# Altium schematic sheet MOC3063S.SchDoc: AC Actuator Control
size 148 x 105 mm; DocumentNumber: 7; SheetNumber: 7; SheetTotal: 10
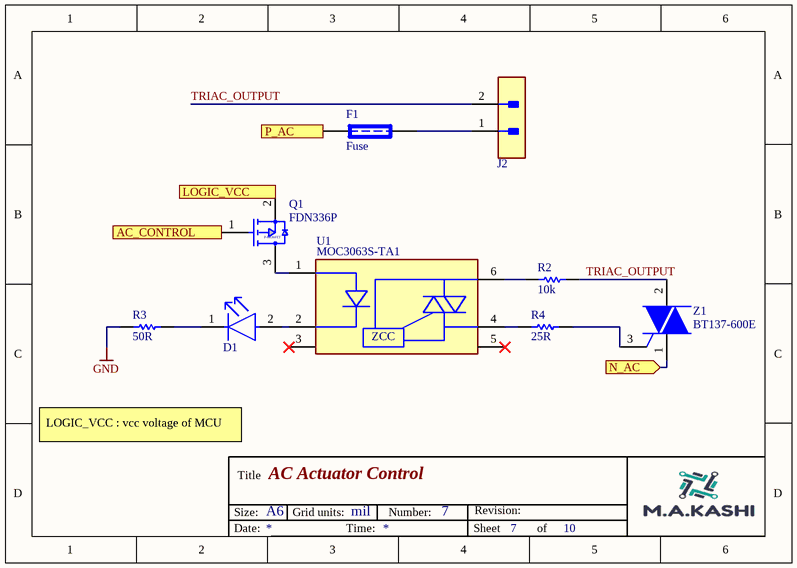
[diagram p0: MOC3063S.SchDoc]

## Parts
D1  LED  [LED_1206_red_Dialight]  (value not drawn)
F1  Fuse  [FUSE]
J2  Connector  [Phoenix 2 0D]  (value not drawn)
Q1  FDN336P  [ON_Semiconductor_527AG_IPC_A]
R2  10k  [RES_0805_A]
R3  50R  [RES_0805_A]
R4  25R  [RES_0805_A]
U1  Part Number: MOC3063S-TA1  [Lite-On_Inc._SMD6_0]  (hidden comment: IC_Lite-On_Inc._MOC3063S-TA1_eec)
Z1  BT137-600E  [sot78]

## Ports
AC_CONTROL (in), LOGIC_VCC (in), N_AC (in), P_AC (in)

## Nets
GND: R3.1
AC_CONTROL: Q1.1(G) ; port AC_CONTROL
LOGIC_VCC: Q1.2(S) ; port LOGIC_VCC
N_AC: Z1.1(T1) ; port N_AC
P_AC: F1.1 ; port P_AC
TRIAC_OUTPUT: J2.2 R2.2 Z1.2(T2)
NetD1_1: D1.1(C) R3.2
NetD1_2: D1.2(A) U1.2(C)
NetF1_2: F1.2 J2.1
NetQ1_3: Q1.3(D) U1.1(A)
NetR2_1: R2.1 U1.6(2_MAIN_TERMINAL)
NetR4_1: R4.1 U1.4(1_MAIN_TERMINAL)
NetR4_2: R4.2 Z1.3(G)

Not connected (* = marked no-connect by the designer): U1 3(NC)* 5(SUBSTRATE)*

## Notes on the sheet
- LOGIC_VCC : vcc voltage of MCU
- Size:
- Title
- A6
- Grid units:
- mil
- Number:
- Revision:
- Date:
- Time:
- Sheet
- of
- (in symbol FDN336P) P-MOSFET
- (in symbol IC_Lite-On_Inc._MOC3063S-TA1_eec) ZCC

## Library data of the parts
D1 = LED: Part Number: Add part number!
J2 = Connector 2 pin: Manufacturer: JST; helpURL: https://upverter.com/upn/revision/9474e29b2dfd49db/; ComponentLink2Description: Datasheet; Temperature: -25°C to +85°C; Package: HDR02; Supplier 2: Mouser; Supplier 1: Digi-Key; ComponentLink1URL: https://upverter.com/upn/revision/9474e29b2dfd49db/; Supplier Part Number 1: 455-2247-ND; ComponentLink1Description: Upverter; ComponentLink2URL: https://upverter.com/datasheet/c48c44605c8b0d25ef64da6eae03f392f2e627c8.pdf; RoHS: TRUE; Temperature Range High: +85°C; Digikey Description: CONN HEADER XH TOP 2POS 2.5MM; Digikey Part Number: 455-2247-ND; Temperature Range Low: -25°C; Lead Free: yes
Q1 = FDN336P: Part Number: DMP3099L-13
R2 R4 = Resistor: octopart or digikey description!; Part Number: ERA-2AEB103X; Voltage Rating: *; Power Rating: *; Tolerance: *
  R2: Resistance: 10k
  R4: Resistance: 25R
R3 = Resistor: octopart or digikey description!; Part Number: RC0402JR-07100RL; Resistance: 50R; Voltage Rating: *; Power Rating: *; Tolerance: *
U1 = IC_Lite-On_Inc._MOC3063S-TA1_eec: IC OPTOISOLATOR 5KV TRIAC 6SMD; Manufacturer: Lite-On Inc.; Mfg Package Ident: SMD6; helpURL: https://upverter.com/upn/revision/a56e6b8ee8ee0b41/; ComponentLink2Description: Datasheet; Temperature: -40°C to +110°C; Package: SMD6; Supplier 2: Mouser; Supplier 1: Digi-Key; ComponentLink1URL: https://upverter.com/upn/revision/a56e6b8ee8ee0b41/; Supplier Part Number 2: 859-MOC3063S-TA1; Supplier Part Number 1: 160-1723-1-ND; ComponentLink1Description: Upverter; ComponentLink2URL: http://optoelectronics.liteon.com/upload/download/DS70-2001-026/MOC306X%20series%20201606.pdf; RoHS: TRUE; Mouser Part Number: 859-MOC3063S-TA1; Temperature Range High: +110°C; Digikey Description: IC OPTOISOLATOR 5KV TRIAC 6SMD; Digikey Part Number: 160-1723-1-ND; Lead Free: yes; Temperature Range Low: -40°C
Z1 = BT137-600E: Part Number: Z0103MN
F1 = Fuse: Published: 8-Jun-2000; LatestRevisionDate: 17-Jul-2002; LatestRevisionNote: Re-released for DXP Platform.; PackageReference: PIN-W2/E2.8; Publisher: Altium Limited